# EAGLE design tastatur (EAGLE 6.5.0)
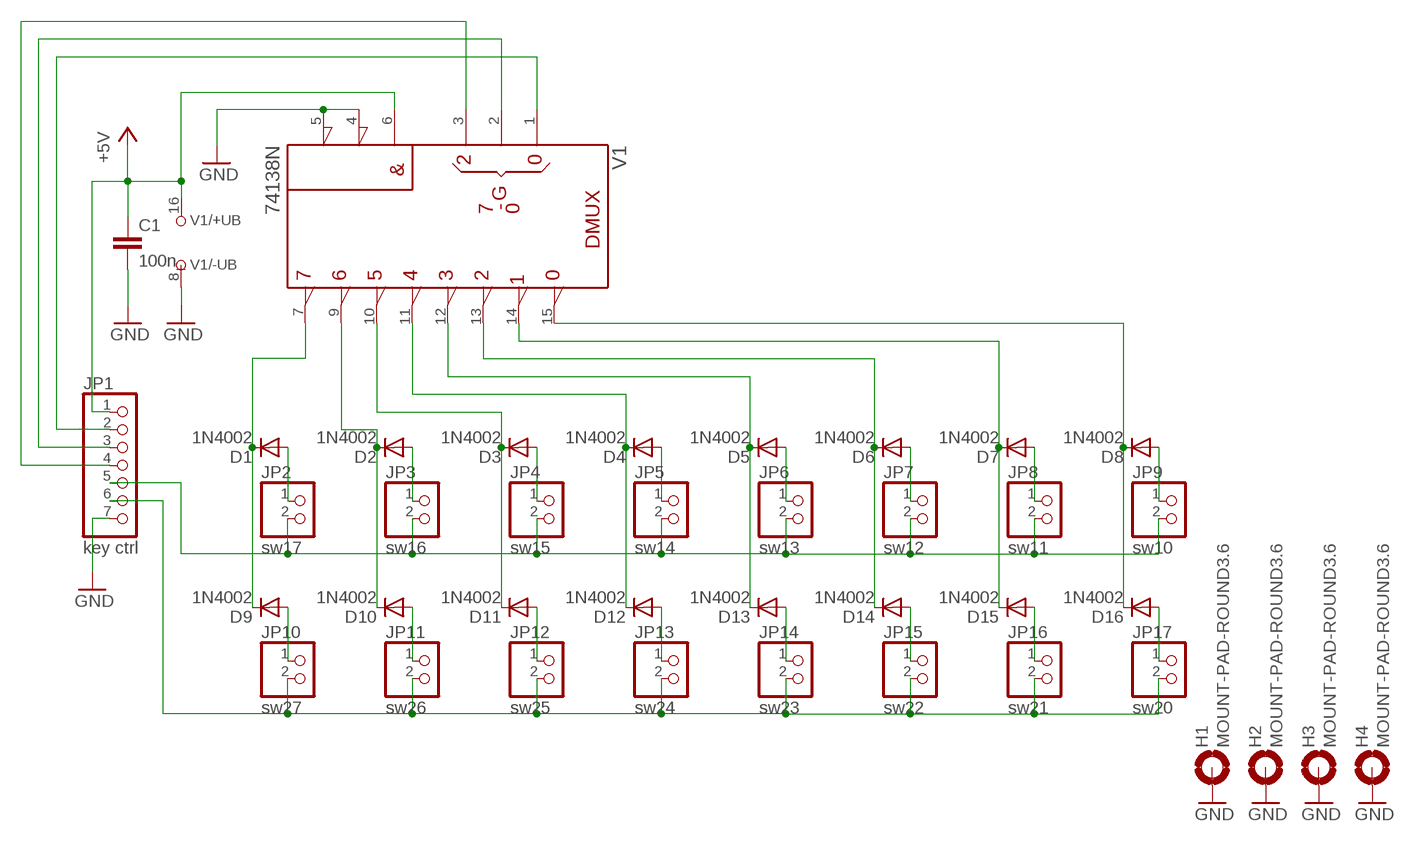
[diagram p0: schematic, sheet 1]

## Parts
C1  100n  C-EU050-024X044  [C050-024X044]
D1  1N4002  [DO41-7.6]
D2  1N4002  [DO41-7.6]
D3  1N4002  [DO41-7.6]
D4  1N4002  [DO41-7.6]
D5  1N4002  [DO41-7.6]
D6  1N4002  [DO41-7.6]
D7  1N4002  [DO41-7.6]
D8  1N4002  [DO41-7.6]
D9  1N4002  [DO41-7.6]
D10  1N4002  [DO41-7.6]
D11  1N4002  [DO41-7.6]
D12  1N4002  [DO41-7.6]
D13  1N4002  [DO41-7.6]
D14  1N4002  [DO41-7.6]
D15  1N4002  [DO41-7.6]
D16  1N4002  [DO41-7.6]
H1  MOUNT-PAD-ROUND3.6  [3,6-PAD]
H2  MOUNT-PAD-ROUND3.6  [3,6-PAD]
H3  MOUNT-PAD-ROUND3.6  [3,6-PAD]
H4  MOUNT-PAD-ROUND3.6  [3,6-PAD]
JP1  key ctrl  PINHD-1X7  [1X07]
JP2  sw17  PINHD-1X2  [1X02]
JP3  sw16  PINHD-1X2  [1X02]
JP4  sw15  PINHD-1X2  [1X02]
JP5  sw14  PINHD-1X2  [1X02]
JP6  sw13  PINHD-1X2  [1X02]
JP7  sw12  PINHD-1X2  [1X02]
JP8  sw11  PINHD-1X2  [1X02]
JP9  sw10  PINHD-1X2  [1X02]
JP10  sw27  PINHD-1X2  [1X02]
JP11  sw26  PINHD-1X2  [1X02]
JP12  sw25  PINHD-1X2  [1X02]
JP13  sw24  PINHD-1X2  [1X02]
JP14  sw23  PINHD-1X2  [1X02]
JP15  sw22  PINHD-1X2  [1X02]
JP16  sw21  PINHD-1X2  [1X02]
JP17  sw20  PINHD-1X2  [1X02]
V1  74138N  [DIL16]

## Nets
+5V: C1.1 JP1.1 V1.6(G1) V1.16(+UB)
ADDR0: JP1.2 V1.1(A)
ADDR1: JP1.3 V1.2(B)
ADDR2: JP1.4 V1.3(C)
COL3: D5.C D13.C V1.12(Y3)
COL4: D4.C D12.C V1.11(Y4)
COL5: D3.C D11.C V1.10(Y5)
COL6: D2.C D10.C V1.9(Y6)
COL7: D1.C D9.C V1.7(Y7)
GND: C1.2 H1.B3,6(MOUNT) H2.B3,6(MOUNT) H3.B3,6(MOUNT) H4.B3,6(MOUNT) JP1.7 V1.4(!G2A) V1.5(!G2B) V1.8(-UB)
IN0: JP1.5 JP2.2 JP3.2 JP4.2 JP5.2 JP6.2 JP7.2 JP8.2 JP9.2
IN1: JP1.6 JP10.2 JP11.2 JP12.2 JP13.2 JP14.2 JP15.2 JP16.2 JP17.2
N$1: D6.C D14.C V1.13(Y2)
N$2: D7.C D15.C V1.14(Y1)
N$3: D8.C D16.C V1.15(Y0)
N$4: D6.A JP7.1
N$5: D7.A JP8.1
N$6: D8.A JP9.1
N$7: D14.A JP15.1
N$8: D5.A JP6.1
N$9: D13.A JP14.1
N$10: D4.A JP5.1
N$11: D12.A JP13.1
N$12: D11.A JP12.1
N$13: D3.A JP4.1
N$14: D2.A JP3.1
N$15: D10.A JP11.1
N$16: D9.A JP10.1
N$17: D1.A JP2.1
N$18: D15.A JP16.1
N$19: D16.A JP17.1

## Library data of the parts
C1 = resistor:C-EU: CAPACITOR, European symbol
D1-D16 = dioden through:1N4002: DIODE general purpose rectifier, 100V, 1 A
H1-H4 = holes:MOUNT-PAD-ROUND: MOUNTING PAD, round
JP1 = pinhead:PINHD-1X7: PIN HEADER
JP2-JP17 = pinhead:PINHD-1X2: PIN HEADER
V1 = 74ttl-din:74*138: 3-line to 8-line DECODER/DEMULTIPLEXER

## Board
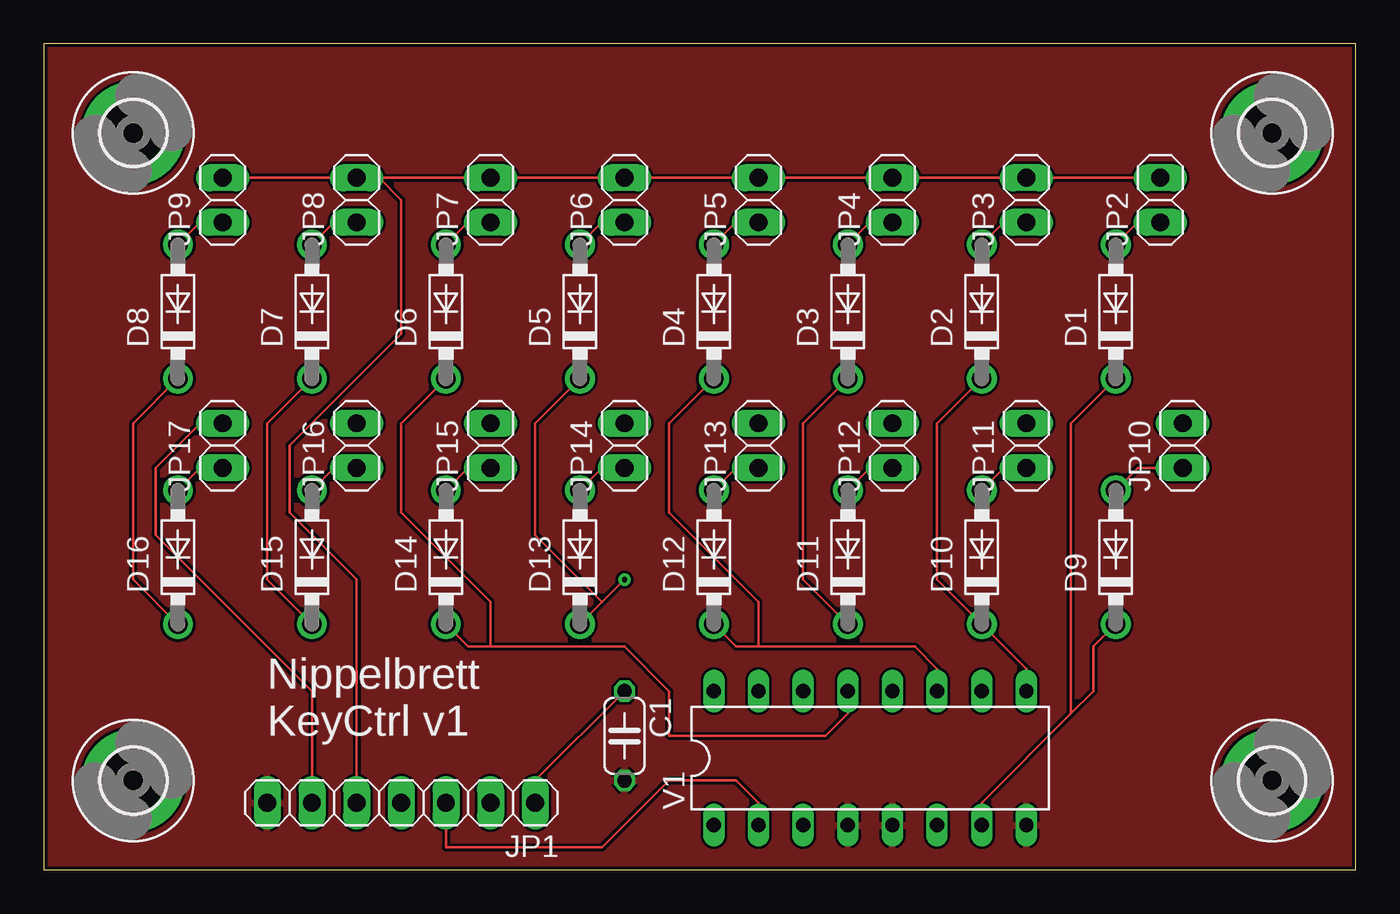
[diagram p1: board, top side]
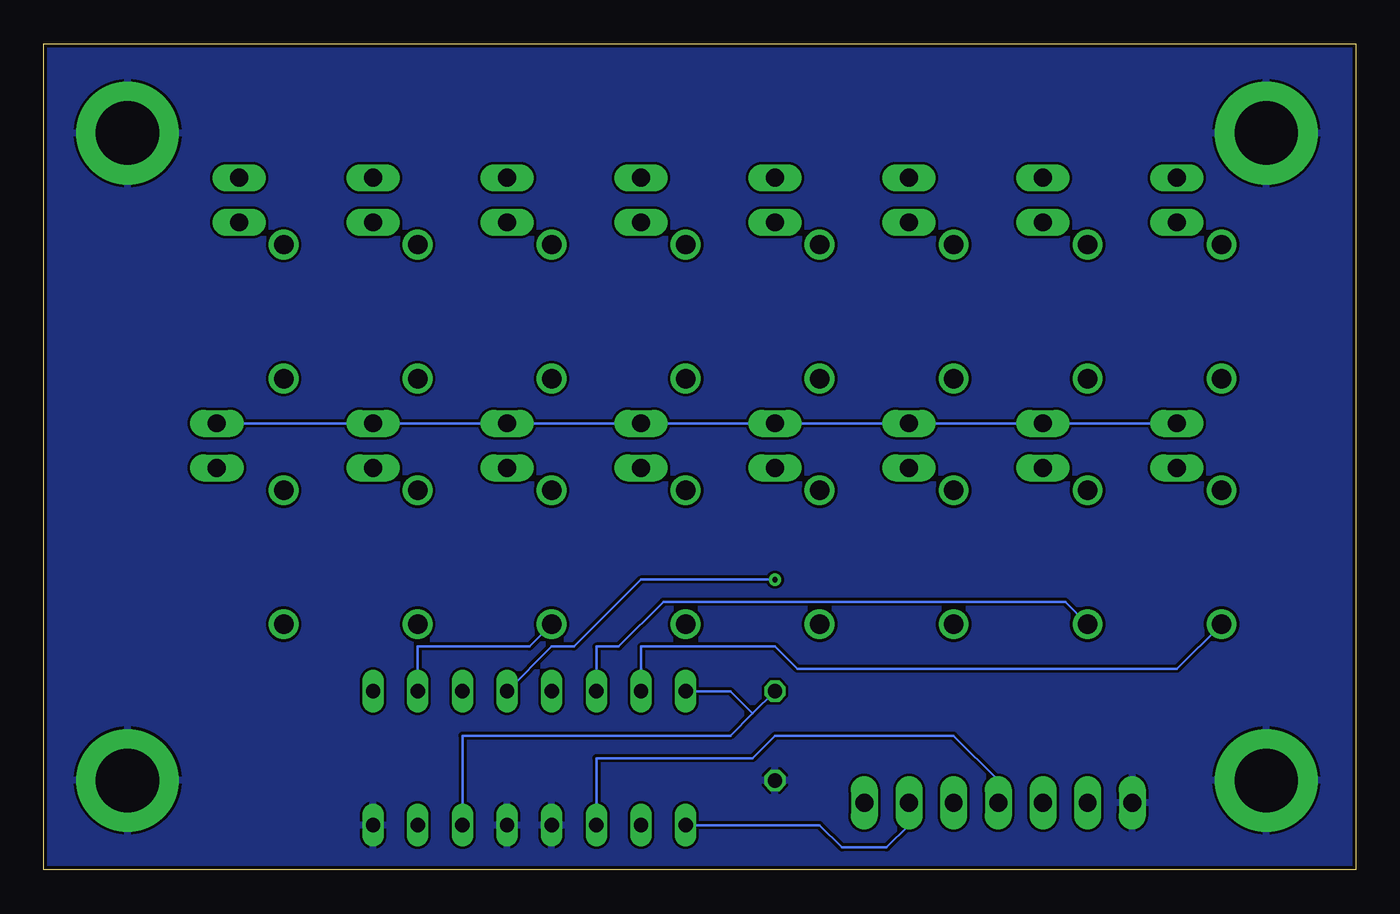
[diagram p2: board, bottom side, seen from below]

Size 74.6 x 46.98 mm. Coordinates in mm from the lower left corner, seen from the top.
Outline: 0,0 74.6,0 74.6,46.98 0,46.98 0,0
Copper layers (1*16): Top 0.035mm / dielectric 1.5mm / Bottom 0.035mm
Design rules "platinensammler_02": minimum track width 0.15mm, minimum drill 0.3mm, track to track 0.15mm, track to pad 0.15mm, pad to pad 0.15mm, via to via 0.15mm, smd to smd 0mil, copper to edge 0.2mm, drill to drill 0.2mm, minimum pad ring 0.2mm, minimum via ring 0.2mm, stop-mask expansion 4mil, vias tented up to drill 0.8mm, thermal gap 0.15mm

### Footprints (pad centres in the part's own frame; a part is rotated, then mirrored left to right if it is on the bottom)
C050-024X044 = drill 0.813 octagon: 1 -2.54,0; 2 2.54,0
DO41-7.6 = drill 1.1 pad 1.7: A 3.81,0; C -3.81,0
3,6-PAD = drill 3.6 pad 5.842: B3,6 0,0
1X07 = drill 1.016 long: 1 -7.62,0; 2 -5.08,0; 3 -2.54,0; 4 0,0; 5 2.54,0; 6 5.08,0; 7 7.62,0
1X02 = drill 1.016 long: 1 -1.27,0; 2 1.27,0
DIL16 = drill 0.813 long: 1 -8.89,-3.81; 2 -6.35,-3.81; 3 -3.81,-3.81; 4 -1.27,-3.81; 5 1.27,-3.81; 6 3.81,-3.81; 7 6.35,-3.81; 8 8.89,-3.81; 9 8.89,3.81; 10 6.35,3.81; 11 3.81,3.81; 12 1.27,3.81; 13 -1.27,3.81; 14 -3.81,3.81; 15 -6.35,3.81; 16 -8.89,3.81

### Placement (x,y rotation side)
C1  33.02,7.62 270 top
D1  60.96,31.75 90 top
D2  53.34,31.75 90 top
D3  45.72,31.75 90 top
D4  38.1,31.75 90 top
D5  30.48,31.75 90 top
D6  22.86,31.75 90 top
D7  15.24,31.75 90 top
D8  7.62,31.75 90 top
D9  60.96,17.78 90 top
D10  53.34,17.78 90 top
D11  45.72,17.78 90 top
D12  38.1,17.78 90 top
D13  30.48,17.78 90 top
D14  22.86,17.78 90 top
D15  15.24,17.78 90 top
D16  7.62,17.78 90 top
H1  69.85,41.91 0 top
H2  69.85,5.08 0 top
H3  5.08,5.08 0 top
H4  5.08,41.91 0 top
JP1  20.32,3.81 180 top
JP2  63.5,38.1 90 top
JP3  55.88,38.1 90 top
JP4  48.26,38.1 90 top
JP5  40.64,38.1 90 top
JP6  33.02,38.1 90 top
JP7  25.4,38.1 90 top
JP8  17.78,38.1 90 top
JP9  10.16,38.1 90 top
JP10  64.77,24.13 90 top
JP11  55.88,24.13 90 top
JP12  48.26,24.13 90 top
JP13  40.64,24.13 90 top
JP14  33.02,24.13 90 top
JP15  25.4,24.13 90 top
JP16  17.78,24.13 90 top
JP17  10.16,24.13 90 top
V1  46.99,6.35 0 top

### Tracks (layer width: path | path; a pad name or v marks a point on that pad's centre or on a via)
+5V
  Top 0.15: C1.1 27.94,5.08 JP1.1
  Bottom 0.15: V1.6 50.8,7.62 35.56,7.62 34.29,8.89 | C1.1 34.29,8.89 | V1.16 35.56,10.16 34.29,8.89
ADDR0
  Bottom 0.15: V1.1 30.48,2.54 29.21,1.27 26.67,1.27 25.4,2.54 JP1.2
ADDR1
  Top 0.15: V1.2 40.64,3.81 39.37,5.08 35.56,5.08 31.75,1.27 22.86,1.27 JP1.3
ADDR2
  Bottom 0.15: V1.3 43.18,6.35 34.29,6.35 33.02,7.62 22.86,7.62 20.32,5.08 JP1.4
COL3  (via drill 0.3)
  Top 0.15: D13.C 31.75,15.24 | 31.75,15.24 v33.02,16.51 | D5.C 27.94,25.4 27.94,19.05 31.75,15.24
  Bottom 0.15: V1.12 45.72,12.7 44.45,12.7 40.64,16.51 v33.02,16.51
COL4
  Top 0.15: V1.11 50.8,11.43 49.53,12.7 40.64,12.7 | 40.64,12.7 39.37,12.7 D12.C | D4.C 35.56,25.4 35.56,20.32 40.64,15.24 40.64,12.7
COL5
  Top 0.15: D3.C 43.18,25.4 43.18,16.51 D11.C
  Bottom 0.15: V1.10 53.34,12.7 46.99,12.7 D11.C
COL6
  Top 0.15: V1.9 55.88,11.43 D10.C 50.8,16.51 50.8,25.4 D2.C
COL7
  Top 0.15: V1.7 53.34,3.81 58.42,8.89 | 58.42,8.89 59.69,10.16 59.69,12.7 D9.C | D1.C 58.42,25.4 58.42,8.89
GND
  pour Bottom: 0,46.99 74.93,46.99 74.93,0 0,0
  pour Top: 74.93,46.99 74.93,0 0,0 0,46.99
IN0
  Top 0.15: JP1.5 17.78,16.51 13.97,20.32 13.97,24.13 20.32,30.48 20.32,38.1 19.05,39.37 | JP9.2 JP8.2 19.05,39.37 | 19.05,39.37 JP7.2 JP6.2 JP5.2 JP4.2 JP3.2 JP2.2
IN1
  Top 0.15: JP1.6 15.24,10.16 6.35,19.05 6.35,22.86 8.89,25.4 JP17.2
  Bottom 0.15: JP17.2 JP16.2 JP15.2 JP14.2 JP13.2 JP12.2 JP11.2 JP10.2
N$1
  Top 0.15: V1.13 45.72,8.89 44.45,7.62 35.56,7.62 35.56,10.16 33.02,12.7 25.4,12.7 | 25.4,12.7 24.13,12.7 D14.C | D6.C 20.32,25.4 20.32,20.32 25.4,15.24 25.4,12.7
N$2
  Top 0.15: D7.C 12.7,25.4 12.7,16.51 D15.C
  Bottom 0.15: V1.14 43.18,12.7 41.91,12.7 39.37,15.24 16.51,15.24 D15.C
N$3
  Top 0.15: D8.C 5.08,25.4 5.08,16.51 D16.C
  Bottom 0.15: V1.15 40.64,12.7 33.02,12.7 31.75,11.43 10.16,11.43 D16.C
N$4
  Top 0.15: JP7.1 24.13,36.83 D6.A
N$5
  Top 0.15: JP8.1 16.51,36.83 D7.A
N$6
  Top 0.15: JP9.1 8.89,36.83 D8.A
N$7
  Top 0.15: JP15.1 24.13,22.86 D14.A
N$8
  Top 0.15: JP6.1 31.75,36.83 D5.A
N$9
  Top 0.15: JP14.1 31.75,22.86 D13.A
N$10
  Top 0.15: JP5.1 39.37,36.83 D4.A
N$11
  Top 0.15: JP13.1 39.37,22.86 D12.A
N$12
  Top 0.15: JP12.1 46.99,22.86 D11.A
N$13
  Top 0.15: JP4.1 46.99,36.83 D3.A
N$14
  Top 0.15: JP3.1 54.61,36.83 D2.A
N$15
  Top 0.15: JP11.1 54.61,22.86 D10.A
N$16
  Top 0.15: JP10.1 62.23,22.86 D9.A
N$17
  Top 0.15: JP2.1 62.23,36.83 D1.A
N$18
  Top 0.15: JP16.1 16.51,22.86 D15.A
N$19
  Top 0.15: JP17.1 8.89,22.86 D16.A

### Text on the board
tNames: Nippelbrett / KeyCtrl v1